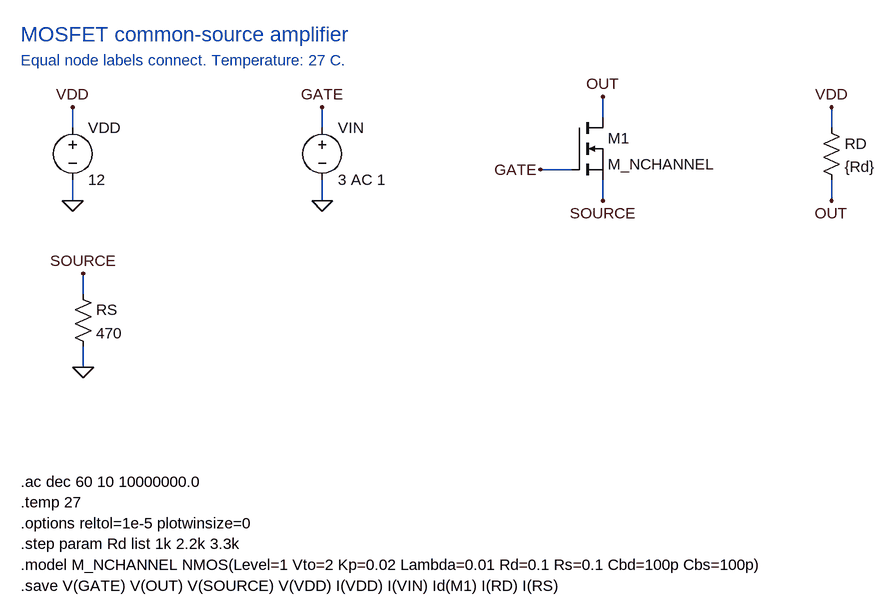
[diagram p0: schematic mosfet-common-source.asc]
mosfet-common-source.asc, the LTspice schematic file:
Version 4
SHEET 1 1740 1032
WIRE 144 176 144 144
WIRE 144 256 144 288
WIRE 528 176 528 144
WIRE 528 256 528 288
WIRE 960 160 960 128
WIRE 912 240 864 240
WIRE 960 256 960 288
WIRE 1312 176 1312 144
WIRE 1312 256 1312 288
WIRE 160 432 160 400
WIRE 160 512 160 544
FLAG 144 144 VDD
FLAG 144 288 0
FLAG 528 144 GATE
FLAG 528 288 0
FLAG 960 128 OUT
FLAG 864 240 GATE
FLAG 960 288 SOURCE
FLAG 1312 144 VDD
FLAG 1312 288 OUT
FLAG 160 400 SOURCE
FLAG 160 544 0
SYMBOL voltage 144 160 R0
SYMATTR InstName VDD
SYMATTR Value 12
SYMBOL voltage 528 160 R0
SYMATTR InstName VIN
SYMATTR Value 3 AC 1
SYMBOL nmos 912 160 R0
SYMATTR InstName M1
SYMATTR Value M_NCHANNEL
SYMBOL res 1296 160 R0
SYMATTR InstName RD
SYMATTR Value {Rd}
SYMBOL res 144 416 R0
SYMATTR InstName RS
SYMATTR Value 470
TEXT 64 32 Left 3 ;MOSFET common-source amplifier
TEXT 64 72 Left 2 ;Equal node labels connect. Temperature: 27 C.
TEXT 64 720 Left 2 !.ac dec 60 10 10000000.0
TEXT 64 752 Left 2 !.temp 27
TEXT 64 784 Left 2 !.options reltol=1e-5 plotwinsize=0
TEXT 64 816 Left 2 !.step param Rd list 1k 2.2k 3.3k
TEXT 64 848 Left 2 !.model M_NCHANNEL NMOS(Level=1 Vto=2 Kp=0.02 Lambda=0.01 Rd=0.1 Rs=0.1 Cbd=100p Cbs=100p)
TEXT 64 880 Left 2 !.save V(GATE) V(OUT) V(SOURCE) V(VDD) I(VDD) I(VIN) Id(M1) I(RD) I(RS)

The netlist it stands for:
* mosfet-common-source.asc
VDD VDD 0 12
VIN GATE 0 3 AC 1
M1 OUT GATE SOURCE SOURCE M_NCHANNEL
RD VDD OUT {Rd}
RS SOURCE 0 470
.model NMOS NMOS
.model PMOS PMOS
.lib standard.mos
* MOSFET common-source amplifier
* Equal node labels connect. Temperature: 27 C.
.ac dec 60 10 10000000.0
.temp 27
.options reltol=1e-5 plotwinsize=0
.step param Rd list 1k 2.2k 3.3k
.model M_NCHANNEL NMOS(Level=1 Vto=2 Kp=0.02 Lambda=0.01 Rd=0.1 Rs=0.1 Cbd=100p Cbs=100p)
.save V(GATE) V(OUT) V(SOURCE) V(VDD) I(VDD) I(VIN) Id(M1) I(RD) I(RS)
.backanno
.end